# EasyEDA schematic BreadBoard_PSU.json
TITLE: Sheet_1; REV: 1.0; Date: 2024-11-28; Sheet: 1/1; Company: Your Company
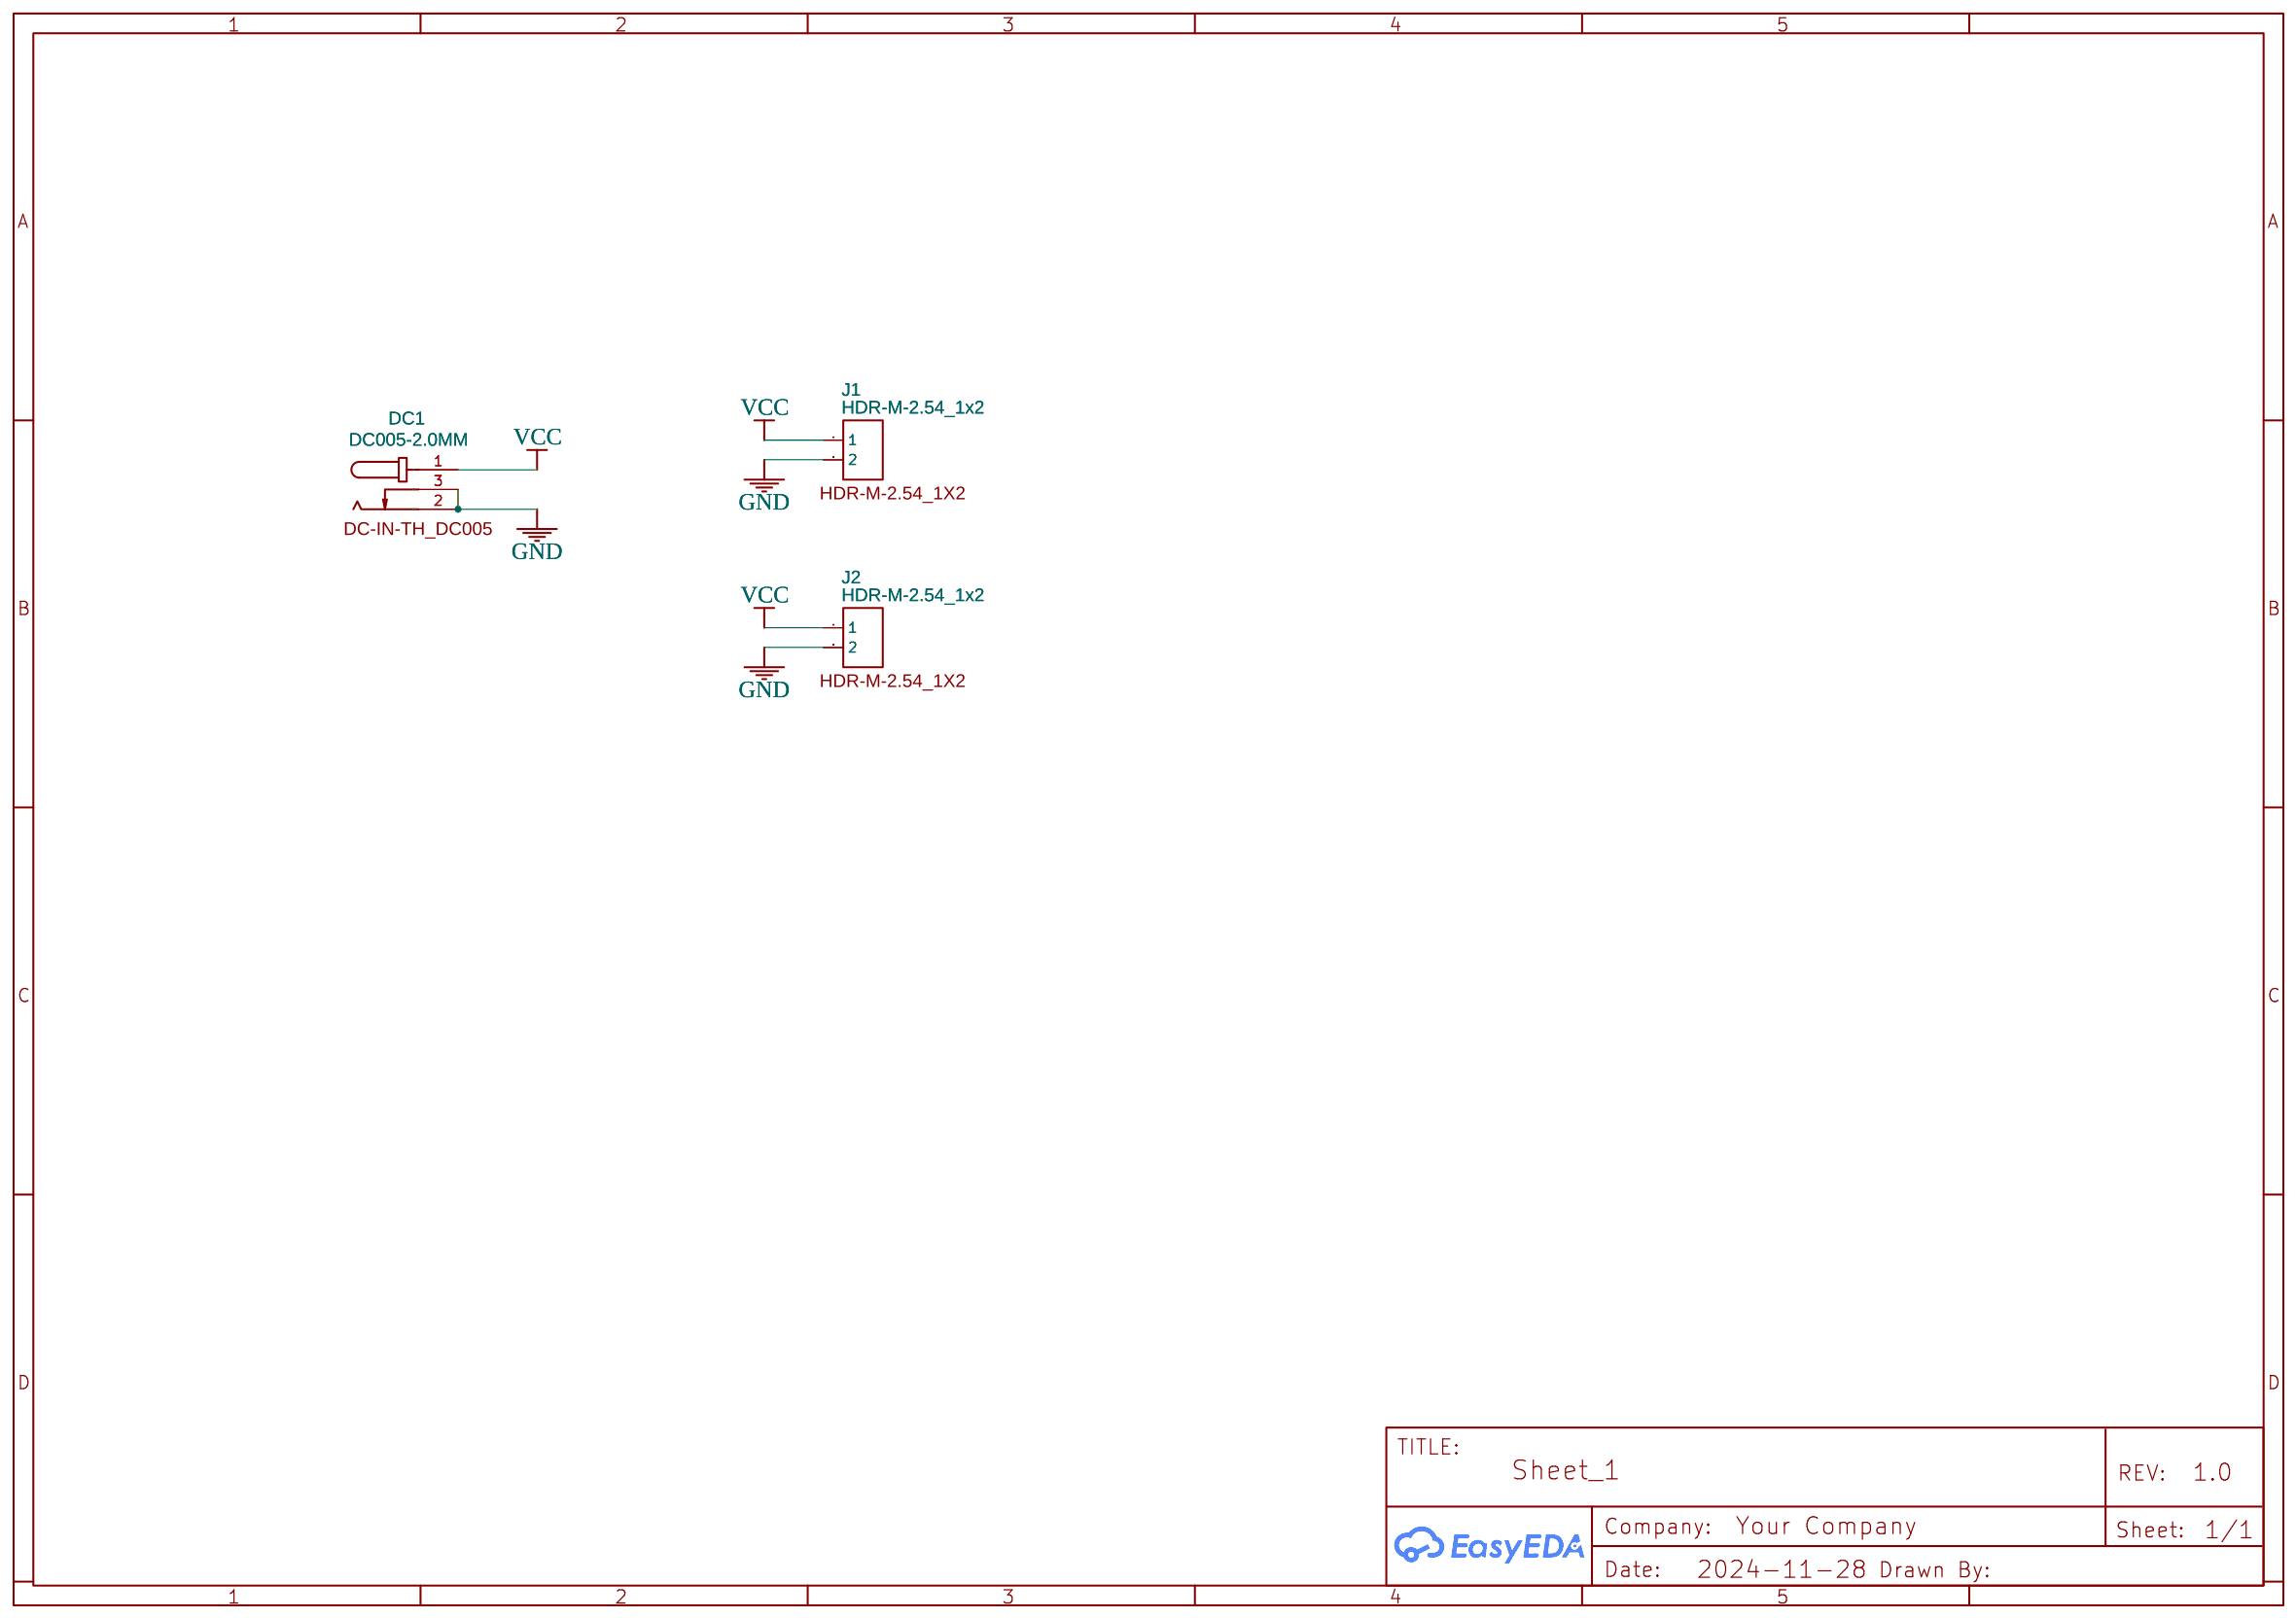
[diagram p0: schematic sheet]

## Parts
DC1  DC005-2.0MM  [DC-IN-TH_DC005]
J1  HDR-M-2.54_1x2  [HDR-M-2.54_1X2]
J2  HDR-M-2.54_1x2  [HDR-M-2.54_1X2]

## Library data of the parts
DC1 = DC005-2.0MM: Supplier: LCSC; Manufacturer: SOFNG; Supplier Part: C111567; Package Display: Yes
J1 J2 = HDR-M-2.54_1x2: Supplier Part: C124375; Supplier: LCSC; Contributor: LCEDA_Lib; Package Display: Yes

## Nets
GND: DC1.2 DC1.3 J1.2 J2.2
VCC: DC1.1 J1.1 J2.1
